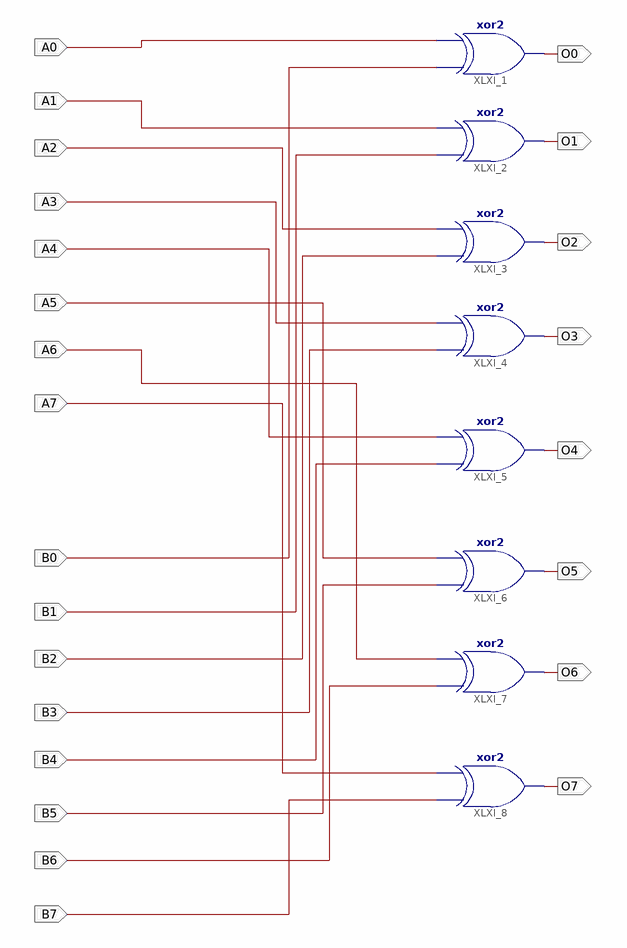
[diagram p0: schematic sheet 1]
// Xilinx ISE schematic Xor8Bit.sch (xc9500xl) as structural Verilog: 8 symbols, 24 ports
module Xor8Bit (
  input  A0,
  input  A1,
  input  A2,
  input  A3,
  input  A4,
  input  A5,
  input  A6,
  input  A7,
  input  B0,
  input  B1,
  input  B2,
  input  B3,
  input  B4,
  input  B5,
  input  B6,
  input  B7,
  output O0,
  output O1,
  output O2,
  output O3,
  output O4,
  output O5,
  output O6,
  output O7
);

  xor XLXI_1 (O0, B0, A0);
  xor XLXI_2 (O1, B1, A1);
  xor XLXI_3 (O2, B2, A2);
  xor XLXI_4 (O3, B3, A3);
  xor XLXI_5 (O4, B4, A4);
  xor XLXI_6 (O5, B5, A5);
  xor XLXI_7 (O6, B6, A6);
  xor XLXI_8 (O7, B7, A7);
endmodule
